# Altium schematic sheet PSU_D.SchDoc: POWER SUPPLY
size A4; Date: 30 08 2013; Author: Rachid AKKOUCHE; CompanyName: RASoftware; DrawnBy: Rachid AKKOUCHE; Engineer: Rachid AKKOUCHE; Organization: RASoftware; Address1: 52 J03, rue de la crèche; Address2: 77100 MEAUX; Address3: FRANCE; DocumentNumber: BRA201308308C; Revision: D; SheetNumber: 8; SheetTotal: 11; Telephone: +33651604047; Email: rachid.akkouche@wanadoo.fr; Proprietaire: MDI System; Dessinepar: -; Verifiepar: -; Time: 19:00
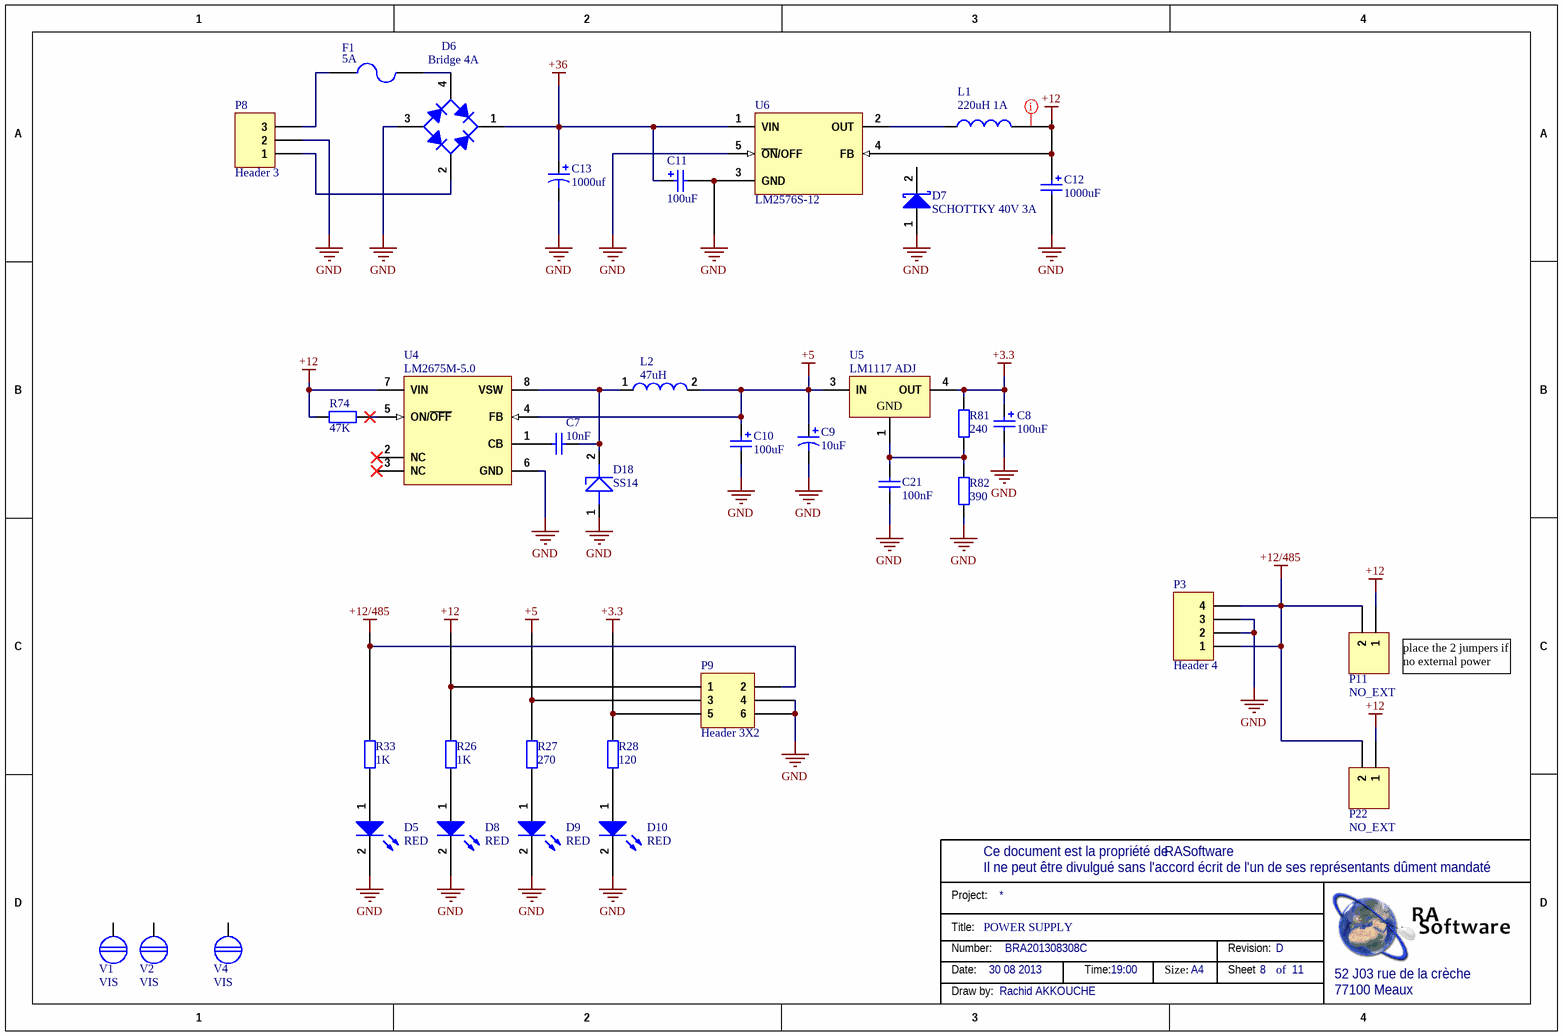
[diagram p0: PSU_D.SchDoc]

## Parts
C7  10nF  [C0805]
C8  100uF  [Kemet_63]  (no BOM)
C9  10uF  [KEMET_4]
C10  100uF  [Kemet_63]
C11  100uF  [Kemet_63]  (no BOM)
C12  1000uF  [KEMET_10]
C13  1000uf  [Capa Panasonic size J16]
C21  100nF  [C0805]
D5  Couleur: RED  [0603-LEDR]  (hidden comment: HSMH-C190)
D6  Bridge 4A  [Pont GBU]
D7  SCHOTTKY 40V 3A  [DO220AA]
D8  Couleur: RED  [0603-LEDR]  (hidden comment: HSMH-C190)
D9  Couleur: RED  [0603-LEDR]  (hidden comment: HSMH-C190)
D10  Couleur: RED  [0603-LEDR]  (hidden comment: HSMH-C190)
D18  SS14  [SMA]
F1  5A  [FUS5X20]
L1  220uH 1A  [IND-1422435C]
L2  47uH  [Self DO3316P]
P3  Header 4  [CO4P508]
P8  Header 3  [CO3P508]
P9  Header 3X2  [M20-2X3]  (no BOM)
P11  NO_EXT  [M20_1X2]
P22  NO_EXT  [M20_1X2]
R26  1K  [R0805]
R27  270  [R0805]
R28  120  [R0805]
R33  1K  [R0805]
R74  47K  [R0805]
R81  240  [R0805]
R82  390  [R0805]
U4  LM2675M-5.0  [SOIC8]
U5  LM1117 ADJ  [SOT223]
U6  LM2576S-12  [TO263-5]
V1  VIS  [VIS42]  (no BOM)
V2  VIS  [VIS42]  (no BOM)
V4  VIS  [VIS42]  (no BOM)

## Nets
+3.3: C8.1 P9.5 R28.2 R81.2 U5.4(OUT)
+5: C9.1 C10.1 L2.2 P9.3 R27.2 U4.4(FB) U5.3(IN)
+12: C12.1 L1.2 P9.1 P11.1 P22.1 R26.2 R74.1 U4.7(VIN) U6.4(FB)
+12/485: P3.1 P3.4 P9.2 P11.2 P22.2 R33.2
+36: C11.1 C13.1 D6.1(K) U6.1(VIN)
GND: C8.2 C9.2 C10.2 C11.2 C12.2 C13.2 C21.1 D5.2(K) D6.3(A) D7.1(A) D8.2(K) D9.2(K) D10.2(K) D18.1(ANOD) P3.2 P3.3 P8.2 P9.4 P9.6 R82.2 U4.6(GND) U6.3(GND) U6.5(~{ON}/OFF)
NetC7_1: C7.1 D18.2(CATH) L2.1 U4.8(VSW)
NetC7_2: C7.2 U4.1(CB)
NetC21_2: C21.2 R81.1 R82.1 U5.1(GND)
NetD5_1: D5.1(A) R33.1
NetD6_2: D6.2(C) P8.1
NetD6_4: D6.4(C) F1.2
NetD8_1: D8.1(A) R26.1
NetD9_1: D9.1(A) R27.1
NetD10_1: D10.1(A) R28.1
NetF1_1: F1.1 P8.3
NetL1_1: L1.1 U6.2(OUT)
NetR74_2: R74.2 U4.5(ON/~{OFF})

Not connected (* = marked no-connect by the designer): D7 2(K); U4 2(NC)* 3(NC)*; V1 1; V2 1; V4 1

## Layout directives
rule Width Constraint [Pref Width = 0.55mm    Min Width = 0.254mm    Max Width = 2mm]: +12

## Notes on the sheet
- (near P11) place the 2 jumpers if no external power
- Ce document est la propriété de
- Project:
- Il ne peut être divulgué sans l'accord écrit de l'un de ses représentants dûment mandaté
- Title:
- Number:
- Date:
- Time:
- Size:
- A4
- Revision:
- Sheet
- of
- 52 J03 rue de la crèche
- Draw by:
- 77100 Meaux

## Library data of the parts
C7 = Cap 0805 10nF: Capacitor; Manufacturer: MULTICOMP; Manufacturer Part Number: MC0805F103Z500CT; Ceramic Capacitor Case: 0805 [2012 Metric]; Capacitance: 0.01; Voltage Rating: 50; Capacitance Tolerance: +80%, -20%; Dielectric Characteristic: Y5; Product Range: MC Series; SVHC: No SVHC (07-Jul-2017); Capacitor Terminals: SMD; Supplier 1: Farnell; Supplier Part Number 1: 1759247; RoHS: YES; Stock 1: 38585; Pricing 1: 10=0.024, 100=0.0171, 500=0.011, 1000=0.0096, 2000=0.0077 (GBP); Packaging: Cut Tape; Operating Temperature Min: -30; Operating Temperature Max: 85; Automotive Qualification Standard: -; MSL: -; Capacitance Tolerance ±: +80%, -20%; Operating Temperature Range: -30°C to +85°C<!--FANDB--><div class="features-and-benefits-container"><div class="features-and-benefits-desc-container"><span class="features-and-benefits-container-desc">SMD Multilayer Ceramic Capacitor, 0805 [2012 Metric], 0.01 µF, 50 V, +80%, -20%, Y5; ComponentLink1URL: http://www.farnell.com/datasheets/1901289.pdf; ComponentLink1Description: http://www.farnell.com/datasheets/1901289.pdf
C8 C10 C11 = Cap Pol 100uF: Polarized Capacitor; Manufacturer: EPCOS; Manufacturer Part Number: B41142A4107M; Product Range: EPCOS - B41142 Series; Capacité: 100; Tolérance de capacité: ± 20%; Tension: 16; Type de boîtier de condensateur: Radial Can - SMD; Diamètre: 6.3; Résistance, ESR: 0.16; Hauteur: 7.7; Courant d'ondulation c.a.: 300; Type de packaging: Cut Tape; Durée de vie @ température: 2000 heures @ 105; Température d'utilisation min: -55; Température de fonctionnement max..: 105; SVHC: No SVHC (19-Dec-2012); Impédance: 0.26; Température de fonctionnement: -55°C à +105; Température, ESR: 20; Type de boîtier: CMS; Supplier 1: Farnell; RoHS: YES; Pricing 1: 10=0,123, 50=0,095, 100=0,078, 250=0,07, 1000=0,062 (EUR); Courant d'ondulation c.a. à  100Hz: 300; Fréquence, impédance: 100; Longueur/hauteur: 7.7; Température, courant ondulatoire: 105; Température, impédance: 20; ComponentLink1URL: http://www.epcos.com/inf/20/30/db/alu_x/B41142.pdf; ComponentLink1Description: http://www.epcos.com/inf/20/30/db/alu_x/B41142.pdf; Supplier Part Number 1: 1735328
C9 = Cap Pol1: Polarized Capacitor (Radial); Manufacturer: KEMET; Manufacturer Part Number: EXV106M016A9BAA; Product Range: KEMET - EXV Series; Capacité: 10; Tolérance de capacité: ± 20%; Diamètre: 4; Hauteur: 5.4; Type de packaging: Cut Tape; Durée de vie @ température: 3000 heures @ 105; Température de fonctionnement max..: 105; Température d'utilisation min: -40; Tension: 16; SVHC: No SVHC (18-Jun-2012); Température de fonctionnement: -40°C à +105; Supplier 1: Farnell; Supplier Part Number 1: 2069163; RoHS: YES; Pricing 1: 10000=0,058 (EUR); Type de boîtier de condensateur: -; MSL: MSL 1 - Illimité; ComponentLink1URL: http://www.farnell.com/datasheets/1500293.pdf; ComponentLink1Description: http://www.farnell.com/datasheets/1500293.pdf
C12 = Cap Pol 1000uF: Polarized Capacitor; Manufacturer: PANASONIC; Manufacturer Part Number: EEEFT1C102AP; Product Range: PANASONIC - FT Series; Capacité: 1000; Tolérance de capacité: ± 20%; Tension: 16; Type de boîtier de condensateur: Radial Can - SMD; Diamètre: 10; Résistance, ESR: 0.06; Hauteur: 10.2; Courant d'ondulation c.a.: 1190; Type de packaging: Cut Tape; Durée de vie @ température: 2000 heures @ 105; Température d'utilisation min: -55; Température de fonctionnement max..: 105; Température de fonctionnement: -55°C à +105; Supplier 1: Farnell; Supplier Part Number 1: 2065974; RoHS: YES; Pricing 1: 5=1,16, 50=0,76, 100=0,49, 500=0,45, 1000=0,44 (EUR); ComponentLink1URL: http://industrial.panasonic.com/www-data/pdf/ABA0000/ABA0000CE135.pdf; ComponentLink1Description: http://industrial.panasonic.com/www-data/pdf/ABA0000/ABA0000CE135.pdf; ComponentLink2URL: http://www.farnell.com/cad/1703921.zip; ComponentLink2Description: http://www.farnell.com/cad/1703921.zip
C13 = Cap Pol1: Polarized Capacitor (Radial); Manufacturer: PANASONIC; Manufacturer Part Number: EEVFK1H102M; Supplier 1: Farnell; Supplier Part Number 1: 9695982; RoHS: YES; Pricing 1: 1=1,91, 50=1,58, 100=0,82, 500=0,79, 1000=0,77 (EUR); ComponentLink1URL: http://industrial.panasonic.com/www-data/pdf/ABA0000/ABA0000CE120.pdf; ComponentLink1Description: http://industrial.panasonic.com/www-data/pdf/ABA0000/ABA0000CE120.pdf; ComponentLink2URL: http://www.farnell.com/cad/1703914.zip; ComponentLink2Description: http://www.farnell.com/cad/1703914.zip
C21 = Cap 0805 100nF: Capacitor; Manufacturer: MULTICOMP; Manufacturer Part Number: MCCA000296; Supplier 1: Farnell; Supplier Part Number 1: 1759167; Pricing 1: 100=0,01, 500=0,008, 1000=0,006, 4000=0,005 (EUR); ComponentLink1URL: http://www.farnell.com/datasheets/1520827.pdf; ComponentLink1Description: http://www.farnell.com/datasheets/1520827.pdf
D5 D8-D10 = HSMH-C190: Surface Mount Chip LED, Red; Manufacturer: AVAGO TECHNOLOGIES; Manufacturer Part Number: HSMH-C190.; Taille de lampe: 0.8mm x 1; Couleur de LED: Rouge; Intensité lumineuse: 17; Angle, vision: 170°; Courant, direct, If: 20; Tension, direct à  If: 1.8; Montage LED: CMS; Forme de lentille: Rectangulaire; Longueur d'onde typ.: 626; SVHC: No SVHC (19-Dec-2012); Dissipation de puissance: 65; Intensité lumineuse min. à  If: 2.8; Intensité lumineuse typique: 10; Largeur (externe): 0.8; Longueur d'onde dominante: 639; Longueur d'onde, crête: 630; Longueur/hauteur: 1.6; Matière: AlGaAs; Nombre de broches: 2; Orientation de montage opto: Dessus; Orientation sortie de lumière: Top Emitting; Température de fonctionnement: -30°C à +85; Température de fonctionnement max..: 85; Température, stockage min.: -40; Température d'utilisation min: -30; Tension, Vf max..: 2.6; Tension, Vf min.: 2.1; Type de LED: Standard; Supplier 1: Farnell; Supplier Part Number 1: 8554641; RoHS: YES; Stock 1: 13902; Pricing 1: 5=0,06, 25=0,059, 100=0,057, 250=0,052, 500=0,047 (EUR); MSL: MSL 2A - 4 semaines; Couleur, LED: Rouge; Profondeur: 0.8; Température, stockage max..: 85; Tension, Vf typ.: 1.8; ComponentLink1URL: http://www.farnell.com/datasheets/313031.pdf; ComponentLink1Description: http://www.farnell.com/datasheets/313031.pdf; ComponentLink2URL: http://www.farnell.com/datasheets/55927.pdf; ComponentLink2Description: http://www.farnell.com/datasheets/55927.pdf
D6 = Bridge1: Full Wave Diode Bridge; Manufacturer: VISHAY GENERAL SEMICONDUCTOR; Manufacturer Part Number: GBU6B-E3/45; Nombre de phases: Une; Tension, Vrrm: 100; Courant, If moy.: 6; Tension, Vf max..: 1; Type de boîtier pont redresseur: GBU; Nombre de broches: 4; Diode Mounting Type: Traversant; Température d'utilisation min: -55; Température de fonctionnement max..: 150; Configuration diode: Double; Courant, Ifs max.: 175; Diode Type: Pont redresseur, monophasé; Hauteur: 18.8; Inflammabilité: UL; Largeur (externe): 22.3; Marquage composant: GBU6; Profondeur: 3.56; Température de fonctionnement: -55°C à +150; Température, Ta: 40; Tension, entrée: 70; Type de borne: Wire lead; Supplier 1: Farnell; Supplier Part Number 1: 9549480; RoHS: YES; Pricing 1: 1=0,53, 25=0,51, 100=0,5, 1000=0,49 (EUR); Courant, sortie max.: 6; Hauteur corps max..: 18.8; Longueur/hauteur: 18.8; Tension, entrée efficace: 70; Type de boîtier: GBU; ComponentLink1URL: http://www.vishay.com/doc?88615; ComponentLink1Description: http://www.vishay.com/doc?88615
D7 = D Schottky: Schottky Diode; Manufacturer: VISHAY; Manufacturer Part Number: SS3P4-M3/84A; Configuration diode: Une; Tension, Vrrm: 40; Courant, If moy.: 3; Tension, Vf max..: 600; Courant, Ifs max.: 50; Température d'utilisation min: -55; Température de fonctionnement max..: 150; Type de boîtier diode: SMP; Nombre de broches: 2; Température de fonctionnement: -55°C à +150; Published: 8-Jun-2000; LatestRevisionDate: 17-Jul-2002; LatestRevisionNote: Re-released for DXP Platform.; PackageReference: SMB; Publisher: Altium Limited; PackageDescription: DO-214-AA/SMB; 2 C-Bend Leads; Body 5.3 x 3.6 mm, inc. leads (LxW); Code_JEDEC: DO-214-AA; Supplier 1: Farnell; Supplier Part Number 1: 1812492; RoHS: YES; Pricing 1: 1=0,25, 25=0,21, 100=0,192, 250=0,188, 500=0,183 (EUR); Diode Type: Schottky; ComponentLink1URL: http://www.vishay.com/docs/88954/ss3p4.pdf; ComponentLink1Description: http://www.vishay.com/docs/88954/ss3p4.pdf
D18 = SCHOTTKY: Manufacturer 1: Fairchild Semiconductor; Description 1: DIODE SCHOTTKY 40V 1A SMA; Forward Current: 1; Max Repetitive Reverse Voltage (Vrrm): 40; Element Configuration: Single; Forward Voltage: 500; Peak Reverse Current: 200; Polarity: Standard; Max Power Dissipation: 1.1; Supplier 1: Farnell; Supplier Part Number 1: 1467537RL; Manufacturer Part Number 1: SS14; Stock 1: 21745; Pricing 1: 1=0.305, 80=0.104, 300=0.0774, 700=0.0561, 2000=0.051, 6000=0.0478 (GBP); Mount: Surface Mount; Case/Package: SMA; Number of Pins: 2; Weight: 0.003739; Number of Terminals: 2; Min Operating Temperature: -65; Max Operating Temperature: 125; Packaging: Tape and Reel; Package Quantity: 7500; Max Forward Surge Current (Ifsm): 40; Current Rating: 1; Peak Non-Repetitive Surge Current: 40; Termination: SMD/SMT; Voltage Rating (DC): 40; Reverse Voltage (DC): 40; Average Rectified Current: 1; Output Current: 1; Current: 1; Voltage: 40; Number of Elements: 1; Power Dissipation: 1.1; Length: 4.75; Height: 2.2; Width: 2.95; Radiation Hardening: No; REACH SVHC: No SVHC; Lead Free: Lead Free; ComponentLink1URL: https://datasheet.ciiva.com/16744/ss14-16744879.pdf; ComponentLink1Description: https://datasheet.ciiva.com/16744/ss14-16744879.pdf; ComponentLink2URL: https://datasheet.ciiva.com/34301/1089027-34301973.pdf; ComponentLink2Description: https://datasheet.ciiva.com/34301/1089027-34301973.pdf; ComponentLink3URL: https://datasheet.ciiva.com/4713/ss14-197224-4713938.pdf; ComponentLink3Description: https://datasheet.ciiva.com/4713/ss14-197224-4713938.pdf; ComponentLink4URL: https://datasheet.ciiva.com/7965/1766303-7965241.pdf; ComponentLink4Description: https://datasheet.ciiva.com/7965/1766303-7965241.pdf; ComponentLink5URL: https://datasheet.ciiva.com/910/ss12-910696.pdf; ComponentLink5Description: https://datasheet.ciiva.com/910/ss12-910696.pdf; ComponentLink6URL: https://datasheet.ciiva.com/22651/1880990-22651980.pdf; ComponentLink6Description: https://datasheet.ciiva.com/22651/1880990-22651980.pdf; ComponentLink7URL: https://datasheet.ciiva.com/910/ss12-910697.pdf; ComponentLink7Description: https://datasheet.ciiva.com/910/ss12-910697.pdf; ComponentLink8URL: https://datasheet.ciiva.com/8303/ss19-8303766.pdf; ComponentLink8Description: https://datasheet.ciiva.com/8303/ss19-8303766.pdf; ComponentLink9URL: https://datasheet.ciiva.com/910/ss12-910695.pdf; ComponentLink9Description: https://datasheet.ciiva.com/910/ss12-910695.pdf; ComponentLink10URL: https://datasheet.ciiva.com/25951/ss19-25951496.pdf; ComponentLink10Description: https://datasheet.ciiva.com/25951/ss19-25951496.pdf
F1 = Fuse 2: Fuse; Manufacturer: KEYSTONE; Manufacturer Part Number: 4527; Fusible 5X20: 1123209; Published: 8-Jun-2000; LatestRevisionDate: 17-Jul-2002; LatestRevisionNote: Re-released for DXP Platform.; PackageReference: PIN-W2/E2.8; Publisher: Altium Limited; PackageDescription: Thru-Hole; 2 Leads; Supplier 1: Farnell; Supplier Part Number 1: 2301274+2301275+1123183; RoHS: YES; Pricing 1: 1=0,59, 250=0,45, 500=0,4, 1000=0,36, 5000=0,33 (EUR); ComponentLink1URL: http://www.keyelco.com/userAssets/file/M60p42.pdf; ComponentLink1Description: http://www.keyelco.com/userAssets/file/M60p42.pdf
L1 = Inductor: Manufacturer: MULTICOMP; Manufacturer Part Number: MCBFS7330-221MU; Gamme de produit: MULTICOMP - MCB Series; Inductance: 220; Tolérance d'Inductance: ± 20%; Construction inductance: Blindé; Résistance DC max.: 0.47; Courant efficace (Irms): 1.2; Type de packaging: Bande découpée; Largeur (externe): 15.24; Longueur/hauteur: 18.54; Nombre de broches: 2; Pas: 12.7; Profondeur: 7.62; Série: MCB<!--FANDB--><div class="features-and-benefits-container"></div>; Supplier 1: Farnell; Supplier Part Number 1: 1864291; RoHS: YES; Stock 1: 2348; Pricing 1: 5=0,37, 50=0,32, 100=0,27, 500=0,25, 1000=0,22 (EUR); Dimensions Boîtier: 18.54mm x 15.24mm x 7.62; ComponentLink1URL: http://www.farnell.com/datasheets/1684913.pdf; ComponentLink1Description: http://www.farnell.com/datasheets/1684913.pdf
L2 = SELF: Manufacturer: COILCRAFT; Manufacturer Part Number: DO3316P-473MLD; Product Range: DO3316; Inductance: 47; RMS Current (Irms): 1.8; Saturation Current (Isat): 1.6; Inductor Construction: Unshielded; DC Resistance Max: 0.14; Power Inductor Case: 12.95mm x 9.4mm x 5.21; Inductance Tolerance: ± 20%; SVHC: No SVHC (12-Jan-2017); Self Resonant Frequency Min: 12MHz<!--FANDB--><div class="features-and-benefits-container"><div class="features-and-benefits-description"><span class="features-benefits-value">The DO3316P-473MLD is a surface mount unshielded Power Inductor with ferrite core. This inductor features gold over nickel over phosphor bronze terminations and is resistance to soldering heat maximum three 40 seconds reflows at +260°C, parts cooled to room temperature between cycles. This inductor also features moisture sensitivity level (MSL) of 1, failures in time (FIT)/mean time between failures (MTBF) is 38 per billion hours/26,315,789 hours, calculated per Telcordia SR-332 and only pure water or alcohol recommended for wash. Current at 25°C causes an inductance drop of 10% typical from its value without current. ±20; Supplier 1: Farnell; Supplier Part Number 1: 2287252; RoHS: YES; Stock 1: 2601; Pricing 1: 1=0.981, 500=0.722 (GBP); Packaging: Cut Tape; ComponentLink1URL: http://www.farnell.com/datasheets/1681904.pdf; ComponentLink1Description: http://www.farnell.com/datasheets/1681904.pdf
P3 = Header 4: Header, 4-Pin; LatestRevisionDate: 17-Jul-2002; LatestRevisionNote: Re-released for DXP Platform.; Publisher: Altium Limited
P8 = Header 3: Header, 3-Pin; Manufacturer: TE CONNECTIVITY / BUCHANAN; Manufacturer Part Number: 796636-3; LatestRevisionDate: 17-Jul-2002; LatestRevisionNote: Re-released for DXP Platform.; Publisher: Altium Limited; Supplier 1: Farnell; Supplier Part Number 1: 2059780; RoHS: YES; Pricing 1: 10=0,68, 100=0,51, 500=0,43, 1000=0,36, 2000=0,35, 5000=0,33 (EUR); ComponentLink1URL: http://www.farnell.com/cad/1652960.pdf; ComponentLink1Description: http://www.farnell.com/cad/1652960.pdf; ComponentLink2URL: http://www.farnell.com/datasheets/1650926.pdf; ComponentLink2Description: http://www.farnell.com/datasheets/1650926.pdf
P9 = Header 3X2: Header, 3-Pin, Dual row; Manufacturer: TE CONNECTIVITY / AMP; Manufacturer Part Number: 1241050-3; LatestRevisionDate: 17-Jul-2002; LatestRevisionNote: Re-released for DXP Platform.; Publisher: Altium Limited; Supplier 1: Farnell; Supplier Part Number 1: 9689567; RoHS: YES; Pricing 1: 1=1,26, 10=1,22, 50=1,2, 100=1,16 (EUR); ComponentLink1URL: http://www.tycoelectronics.com/commerce/DocumentDelivery/DDEController?Action=srchrtrv&DocNm=1241050-3&DocType=Customer+View+Model&DocLang=English; ComponentLink1Description: http://www.tycoelectronics.com/commerce/DocumentDelivery/DDEController?Action=srchrtrv&DocNm=1241050-3&DocType=Customer+View+Model&DocLang=English; ComponentLink2URL: http://www.te.com/commerce/DocumentDelivery/DDEController?Action=showdoc&DocId=Customer+Drawing%7F1241050%7FA9%7Fpdf%7FEnglish%7FENG_CD_1241050_A9.pdf%7F1241050-5; ComponentLink2Description: http://www.te.com/commerce/DocumentDelivery/DDEController?Action=showdoc&DocId=Customer+Drawing%7F1241050%7FA9%7Fpdf%7FEnglish%7FENG_CD_1241050_A9.pdf%7F1241050-5; ComponentLink3URL: http://www.farnell.com/datasheets/318453.pdf; ComponentLink3Description: http://www.farnell.com/datasheets/318453.pdf
P11 P22 = Header 2: Header, 2-Pin; Manufacturer: HARWIN; Manufacturer Part Number: M20-8770242; Product Range: HARWIN - M20-87 Series; Terminaison du contact: PCB; Genre: Connecteur mâle; Nombre de contacts: 2; Nombre de rangées: 1; Pas: 2.54; Plaquage du contact: Or; Matériau du contact: Laiton; SVHC: No SVHC (20-Jun-2013); LatestRevisionDate: 17-Jul-2002; LatestRevisionNote: Re-released for DXP Platform.; Publisher: Altium Limited; Supplier 1: Farnell; Supplier Part Number 1: 1895211; RoHS: YES; Pricing 1: 10=0,137, 20=0,136, 50=0,135, 100=0,133, 250=0,128, 500=0,12 (EUR); ComponentLink1URL: http://www.farnell.com/cad/1330190.pdf; ComponentLink1Description: http://www.farnell.com/cad/1330190.pdf
R26 R28 R33 = Resistor 0805 1K: Resistor; Manufacturer: MULTICOMP; Manufacturer Part Number: MC0.1W08051%1KFR; Product Range: MULTICOMP - MC Series; Résistance: 1; Puissance: 100; Tolérance de résistance: ± 1%; Type de boîtier de résistance: 0805; Type de résistance: Couche épaisse; Coefficient de température: ± 100; Tension: 150; Type de packaging: Full Reel; Resistor Mounting: CMS; Supplier 1: Farnell; RoHS: YES; Pricing 1: 5000=0,001 (EUR); MSL: MSL 1 - Illimité; ComponentLink1URL: http://www.farnell.com/datasheets/1716700.pdf; ComponentLink1Description: http://www.farnell.com/datasheets/1716700.pdf; Supplier Part Number 1: 2129113
R27 = Resistor 0805 270: Resistor; Manufacturer: MULTICOMP; Manufacturer Part Number: MC01W08051270R; Product Range: MULTICOMP - MC Series; Puissance: 100; Tolérance de résistance: ± 1%; Type de boîtier de résistance: 0805; Type de résistance: Couche épaisse; Coefficient de température: ± 100; Tension: 150; Type de packaging: Full Reel; SVHC: No SVHC (20-Jun-2013); Resistor Mounting: CMS; Supplier 1: Farnell; RoHS: YES; Pricing 1: 5000=0,001 (EUR); Résistance: 270; MSL: (Non Applicable); ComponentLink1URL: http://www.farnell.com/datasheets/1729047.pdf; ComponentLink1Description: http://www.farnell.com/datasheets/1729047.pdf; Supplier Part Number 1: 2129067
R74 = Resistor 0805 47K: Resistor; Manufacturer: MULTICOMP; Manufacturer Part Number: MC0.1W08051%47KFR; Product Range: MULTICOMP - MC Series; Résistance: 47; Puissance: 100; Tolérance de résistance: ± 1%; Type de boîtier de résistance: 0805; Type de résistance: Couche épaisse; Coefficient de température: ± 100; Tension: 150; Type de packaging: Full Reel; Resistor Mounting: CMS; Supplier 1: Farnell; Supplier Part Number 1: 2129250; RoHS: YES; Stock 1: 354994; Pricing 1: 5000=0,001 (EUR); MSL: MSL 1 - Illimité; ComponentLink1URL: http://www.farnell.com/datasheets/1636796.pdf; ComponentLink1Description: http://www.farnell.com/datasheets/1636796.pdf
R81 = Resistor 0805 240: Resistor; Manufacturer: Multicomp; Manufacturer Part Number: MCWR06X2400FTL; Resistance: 240R; Power Rating: 100mW; Tolerance: 1%; Voltage Rating: 50V; Temperature Coefficient: 100ppm/°C; ComponentLink1URL: http://www.farnell.com/datasheets/1716700.pdf; ComponentLink1Description: http://www.farnell.com/datasheets/1716700.pdf; Supplier 1: Farnell; Stock 1: 0; Mount: Surface Mount; Case/Package: 0603; Case Code (Metric): 1608; Case Code (Imperial): 0603; Packaging: Cut Tape; Composition: Thick Film; Voltage Rating (DC): 50V; REACH SVHC: No SVHC; ComponentLink2URL: http://www.farnell.com/datasheets/1849611.pdf; ComponentLink2Description: http://www.farnell.com/datasheets/1849611.pdf; Supplier Part Number 1: 2447305
R82 = Resistor 0805 390: Resistor; Manufacturer: Multicomp; Manufacturer Part Number: MC0.063W06031%390R; Resistance: 390R; Power Rating: 63mW; Tolerance: 1%; Voltage Rating: 50V; Temperature Coefficient: 100ppm/°C; ComponentLink1URL: http://www.farnell.com/datasheets/1716700.pdf; ComponentLink1Description: http://www.farnell.com/datasheets/1716700.pdf; ComponentLink2URL: http://www.farnell.com/datasheets/1849611.pdf; ComponentLink2Description: http://www.farnell.com/datasheets/1849611.pdf; Supplier 1: Farnell; Stock 1: 0; Case/Package: 0603; Number of Pins: 2; Case Code (Metric): 1608; Case Code (Imperial): 0603; Min Operating Temperature: -55°C; Max Operating Temperature: 155°C; Packaging: Tape and Reel; Composition: Thick Film; Voltage Rating (DC): 50V; Width: 0.8mm; REACH SVHC: No SVHC; ComponentLink3URL: http://www.farnell.com/datasheets/1788326.pdf; ComponentLink3Description: http://www.farnell.com/datasheets/1788326.pdf; Supplier Part Number 1: 9331131RL
U4 = LM2675M-5.0: SIMPLE SWITCHER® Power Converter High Efficiency 1A Step-Down Voltage Regulator, 8-pin Narrow SOIC; Manufacturer: National Semiconductor; PackageTopMarking: NSZXTT*2675*M5.0; PowerWise: N; Published: 4-Dec-2008; DatasheetVersion: Jun-2005; PackageVersion: revM, May-2009; PackageReference: M08A; Publisher: Altium Limited; PackageDescription: SOIC Narrow, 4.9 x 3.9 x 1.45mm, 8 Lead, 1.27mm Pitch; Supplier 1: Farnell; Supplier Part Number 1: 9489746; PartNumber: LM2675M-5.0; RoHS: N; PinCount: 8; CompType: Switcher; Code_JEDEC: MS-012-AA; Code_IPC: SOIC127P600-8; ComponentLink1Description: LM2675 Datasheet; ComponentLink1URL: http://www.national.com/ds/LM/LM2675.pdf; ComponentLink2Description: LM2675 Web Page; ComponentLink2URL: http://www.national.com/pf/LM/LM2675.html; ComponentLink3Description: M08A Package Page; ComponentLink3URL: http://www.national.com/packaging/folders/m08a.html
U5 = LM1117DT-ADJ: 800mA Adjustable low-Dropout Linear Regulator, 3-pin SOT223; Manufacturer: Texas Instruments; Manufacturer Part Number: LM1117IMP-ADJ/NOPB; Polarity: Positive; Min Input Voltage: 2.6V; Max Input Voltage: 15V; Dropout Voltage: 1.2V; Output Voltage: 13.8V; Number of Outputs: 1; Max Supply Voltage: 13.75V; Min Supply Voltage: 1.5V; Min Output Voltage: 1.25V; Reference Voltage: 1.262V; Accuracy: 1%; Quiescent Current: 5mA; Current Rating: 800A; ComponentLink1URL: http://www.ti.com/lit/ds/symlink/tlv1117.pdf; ComponentLink1Description: http://www.ti.com/lit/ds/symlink/tlv1117.pdf; ComponentLink2URL: http://www.farnell.com/cad/1614300.zip; ComponentLink2Description: http://www.farnell.com/cad/1614300.zip; Supplier 1: Farnell; Stock 1: 0; Mount: Surface Mount; Case/Package: SOT-223; Number of Pins: 4; Contact Plating: Matte,Tin; Min Operating Temperature: -40°C; Max Operating Temperature: 125°C; Packaging: Tape and Reel; Output Current: 800mA; Max Output Current: 800mA; Max Output Voltage: 13.8V; Termination: SMD/SMT; Output Voltage Accuracy: 1%; Output Type: Adjustable; Length: 6.5mm; Height: 1.6mm; Width: 3.56mm; REACH SVHC: No SVHC; Lead Free: Lead Free; ComponentLink3URL: http://www.farnell.com/datasheets/1882372.pdf; ComponentLink3Description: http://www.farnell.com/datasheets/1882372.pdf; ComponentLink4URL: http://www.jameco.com/Jameco/Products/ProdDS/1992048.pdf; ComponentLink4Description: http://www.jameco.com/Jameco/Products/ProdDS/1992048.pdf; Supplier Part Number 1: 2435808
U6 = LM2576HVT-12: SIMPLE SWITCHER® 3A Step-Down Voltage Regulator, 5-pin TO-220; Manufacturer: TEXAS INSTRUMENTS; Manufacturer Part Number: LM2576HVS-12/NOPB; Tension d'entrée primaire: 60; Nombre de canaux de sortie: 1; Tension, sortie: 12; Courant, sortie: 3; Type de boîtier CI régulateur de tension: TO-263; Nombre de broches: 5; Température d'utilisation min: -40; Température de fonctionnement max..: 125; SVHC: No SVHC (20-Jun-2013); Racine de la référence: 2576; Température de fonctionnement: -40°C à +125; Supplier 1: Farnell; Supplier Part Number 1: 2115115; RoHS: YES; Pricing 1: 1=4,23, 10=3,19, 100=2,48, 250=2,41, 500=2,35 (EUR); MSL: MSL 3 - 168 heures; ComponentLink1URL: http://www.farnell.com/datasheets/1520137.pdf; ComponentLink1Description: http://www.farnell.com/datasheets/1520137.pdf